# EAGLE schematic oven_high_voltage (EAGLE 8.3.2)
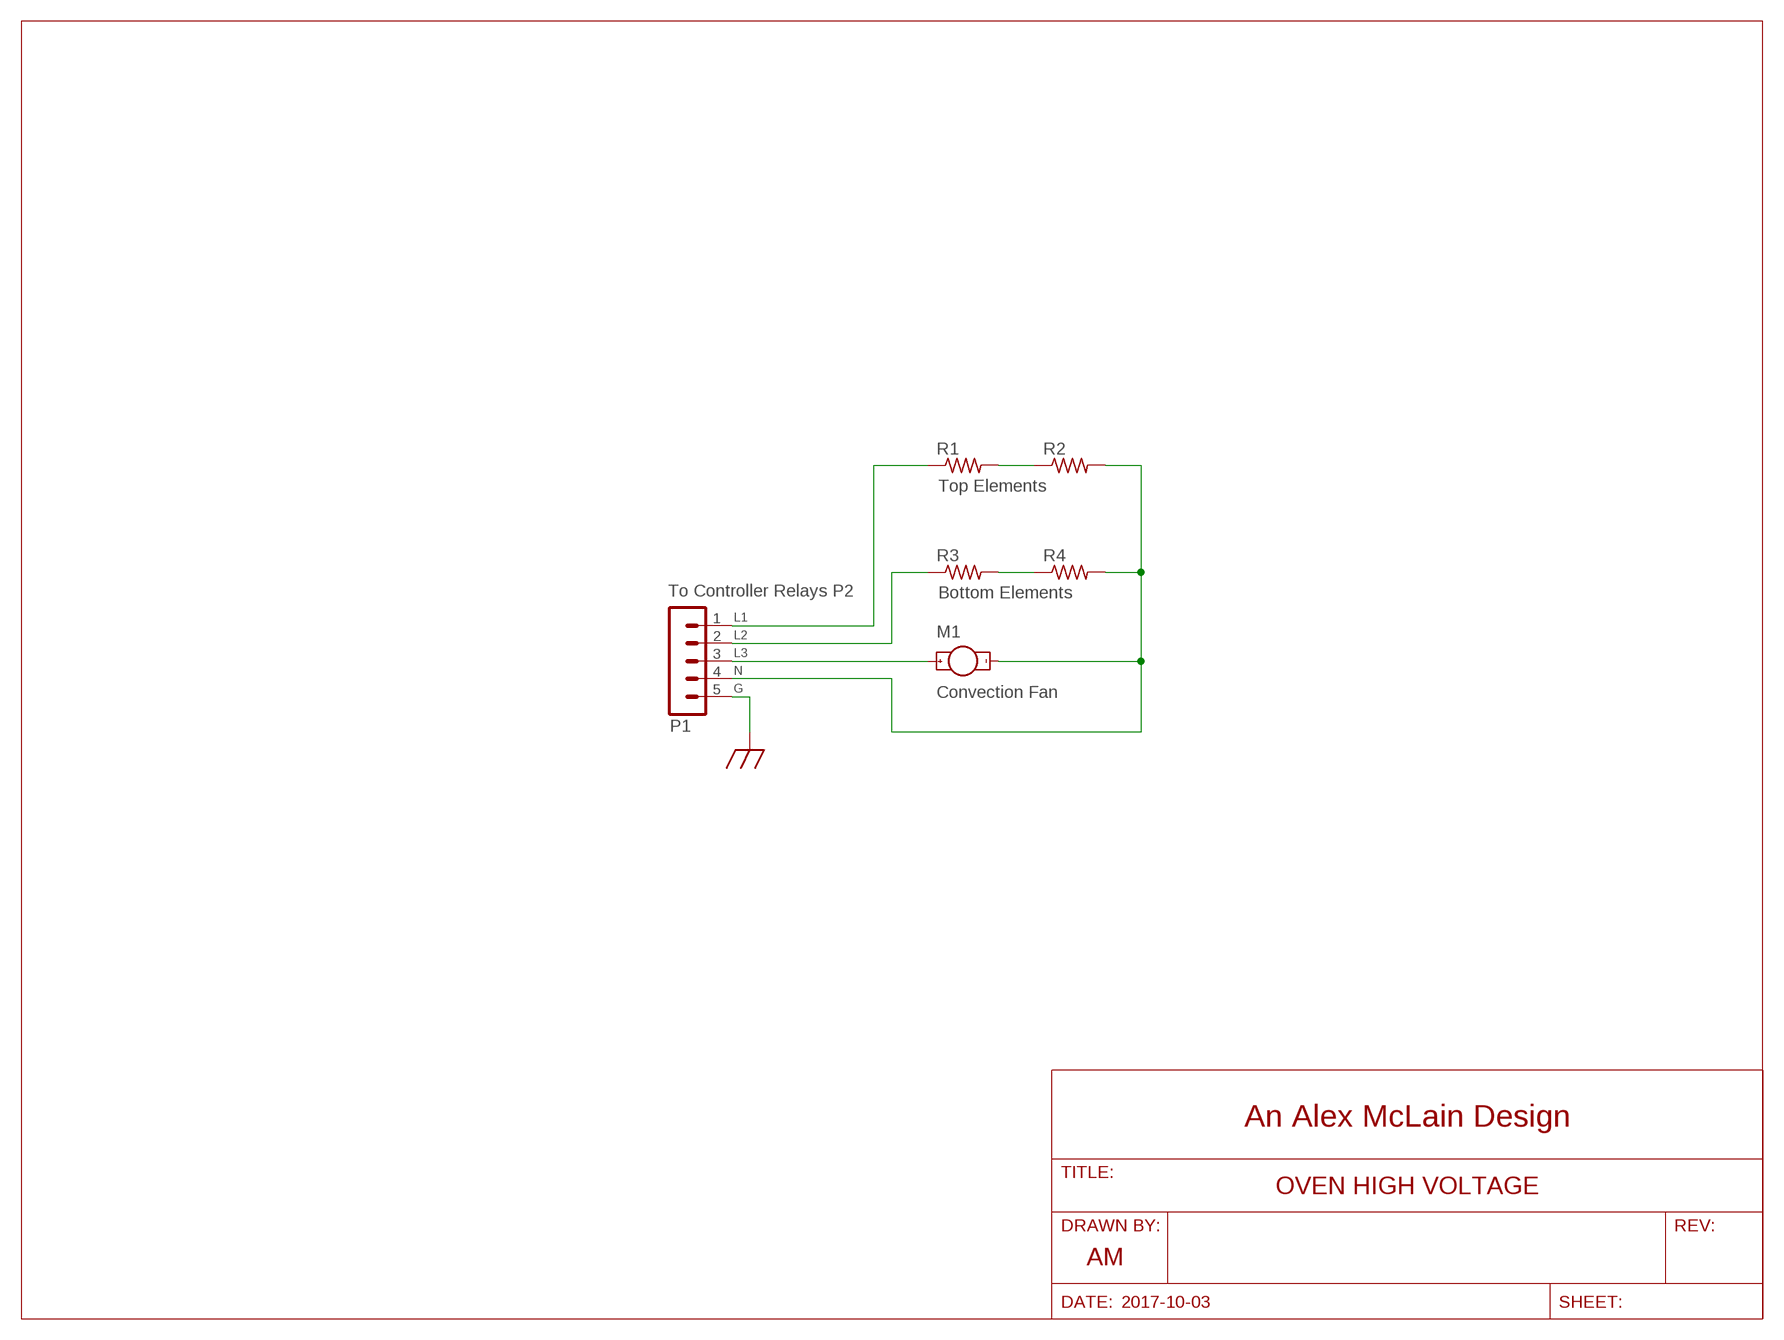
[diagram p0: schematic, sheet 1]
FRAME1 (LETTER_L): COMPANY_NAME: An Alex McLain Design; DATE_DRAWN: 2017-10-03; DRAWN_BY: AM; TITLE: OVEN HIGH VOLTAGE

## Parts
M1  Convection Fan  MOTOR10MM  [VIBE-MOTOR-10MM]
P1  MA05-1  [MA05-1]
R1  R-US_0204/7  [0204/7]
R2  R-US_0204/7  [0204/7]
R3  R-US_0204/7  [0204/7]
R4  R-US_0204/7  [0204/7]

## Nets
GND: P1.5 ; supply symbol labelled CGND
N$1: M1.+ P1.3
N$2: R1.2 R2.1
N$3: R3.2 R4.1
N$4: P1.2 R3.1
N$5: P1.1 R1.1
N$6: M1.- P1.4 R2.2 R4.2

## Notes on the sheet
- Top Elements
- To Controller Relays P2 | Bottom Elements
- L1
- L2
- L3
- N
- G

## Library data of the parts
M1 = SparkFun-Electromechanical:MOTOR: Motor (Single-Phase) Two-terminal, single-phase motors. SparkFun Products Vibration Motor <https://www.sparkfun.com/products/8449> (ROB-08449) Physical dimension and wire connections for this powerful vibration motor. Motor has a self adhesive backing.; PROD_ID: COMP-08572; SF_SKU: ROB-08449
P1 = con-lstb:MA05-1: PIN HEADER; OC_FARNELL: unknown; OC_NEWARK: unknown
R1-R4 = resistor:R-US_: RESISTOR, American symbol